# Altium schematic sheet Rumble.SchDoc
size A4
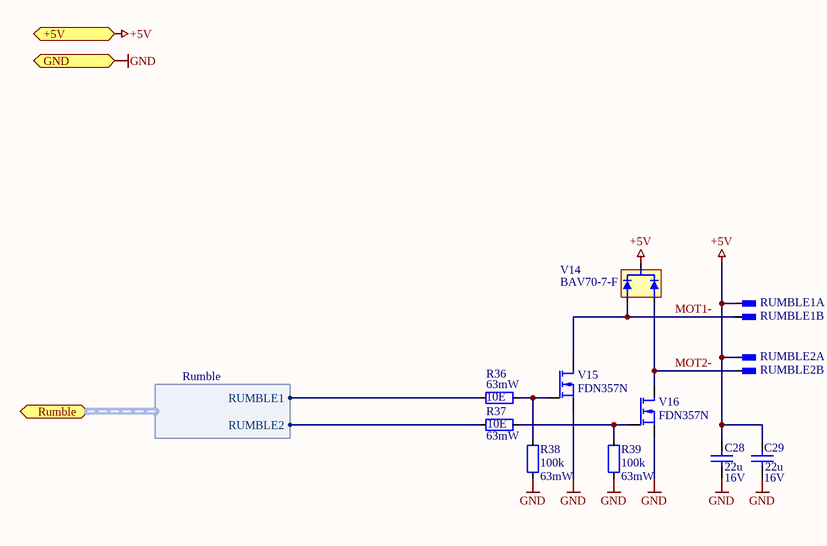
[diagram p0: Rumble.SchDoc]

## Parts
C28  value 22u  Value2: 16V  [SMD_CAP_0805]  (hidden comment: C_SMD_CER_22U_16V_10%_X5R_0805)
C29  value 22u  Value2: 16V  [SMD_CAP_0805]  (hidden comment: C_SMD_CER_22U_16V_10%_X5R_0805)
R36  value 10E  Value2: 63mW  [SMD_RES_0402]  (hidden comment: R_SMD_THINFILM_10E_0W063_0%5_50PPM_0402)
R37  value 10E  Value2: 63mW  [SMD_RES_0402]  (hidden comment: R_SMD_THINFILM_10E_0W063_0%5_50PPM_0402)
R38  value 100k  Value2: 63mW  [SMD_RES_0402]  (hidden comment: R_SMD_THINFILM_100K_0W063_1%_50PPM_0402)
R39  value 100k  Value2: 63mW  [SMD_RES_0402]  (hidden comment: R_SMD_THINFILM_100K_0W063_1%_50PPM_0402)
RUMBLE1  X_CONNECTOR_P2.54_D0.9_1X2  [THT_CON_P2.54_D0.9_1X2]  (value not drawn)  (parts A,B of 2)
RUMBLE2  X_CONNECTOR_P2.54_D0.9_1X2  [THT_CON_P2.54_D0.9_1X2]  (value not drawn)  (parts A,B of 2)
V14  Type: BAV70-7-F  [SMD_SOT_23_3]  (hidden comment: V_SMD_DIODE_ARRAY_75V_0A15_SOT23-3)
V15  Type: FDN357N  [SMD_SOT_23_3]  (hidden comment: V_SMD_FET_NMOS_FDN357N_30V_1A9_4NC2_0W5_SOT-23-3)
V16  Type: FDN357N  [SMD_SOT_23_3]  (hidden comment: V_SMD_FET_NMOS_FDN357N_30V_1A9_4NC2_0W5_SOT-23-3)

## Ports
+5V, GND, Rumble (harness Rumble)

## Harnesses
Rumble: RUMBLE1, RUMBLE2

## Nets
+5V: C28.2 C29.2 RUMBLE1.1 RUMBLE2.1 V14.3(Cathode) ; port +5V
GND: C28.1 C29.1 R38.1 R39.1 V15.2(Source) V16.2(Source) ; port GND
MOT1-: RUMBLE1.2 V14.1(Anode) V15.3(Drain)
MOT2-: RUMBLE2.2 V14.2(Anode) V16.3(Drain)
NetR36_1: R36.1 ; port Rumble.RUMBLE1
NetR36_2: R36.2 R38.2 V15.1(Gate)
NetR37_1: R37.1 ; port Rumble.RUMBLE2
NetR37_2: R37.2 R39.2 V16.1(Gate)

## Notes on the sheet
- Title
- Size:
- Date:
- A4
- Number:
- Time:
- Revision:
- Sheet
- of
- File:

## Library data of the parts
C28 C29 = C_SMD_CER_22U_16V_10%_X5R_0805: 22µF ±10% 16V Ceramic Capacitor X5R 0805 (2012 Metric); Supplier - Digikey: 1276-7092-1-ND
R36 R37 = R_SMD_THINFILM_10E_0W063_0%5_50PPM_0402: 10 Ohms ±0.5% 0.063W, 1/16W Chip Resistor 0402 (1005 Metric) Thin Film; Supplier - Digikey: 311-10UCT-ND
R38 R39 = R_SMD_THINFILM_100K_0W063_1%_50PPM_0402: 100 kOhms ±1% 0.063W, 1/16W Chip Resistor 0402 (1005 Metric) Thin Film; Supplier - Digikey: YAG2307CT-ND
RUMBLE1 RUMBLE2 = X_CONNECTOR_P2.54_D0.9_1X2: Pitch 2.54, Diameter 0.9mm, 1 row, 2 columns; Type: Pitch 2.54, Diameter 0.9mm, 1 row, 2 columns
V15 V16 = V_SMD_FET_NMOS_FDN357N_30V_1A9_4NC2_0W5_SOT-23-3: N-Channel Logic Level Enhancement Mode Field Effect Transistor; Supplier - E+H-flowtec SAP: 50110216; Supplier - Digikey: FDN357NCT-ND
V14 = V_SMD_DIODE_ARRAY_75V_0A15_SOT23-3: Supplier - Digikey: BAV70-FDICT-ND